# EAGLE design konektor_2 (EAGLE 6.3)
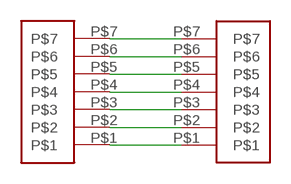
[diagram p0: schematic, sheet 1]

## Parts
U$1  7PIN  [7PIN]
U$2  7PIN  [7PIN]

## Nets
N$3: U$1.P$6 U$2.P$6
N$4: U$1.P$5 U$2.P$5
N$5: U$1.P$4 U$2.P$4
N$6: U$1.P$3 U$2.P$3
N$7: U$1.P$2 U$2.P$2
N$8: U$1.P$1 U$2.P$1
N$9: U$1.P$7 U$2.P$7

## Library data of the parts
U$1 U$2 = ref-packages:7PIN

## Board
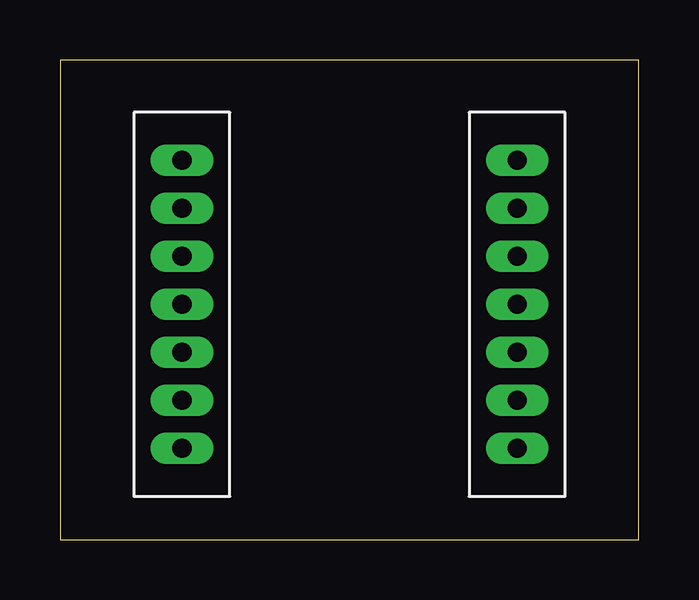
[diagram p1: board, top side]
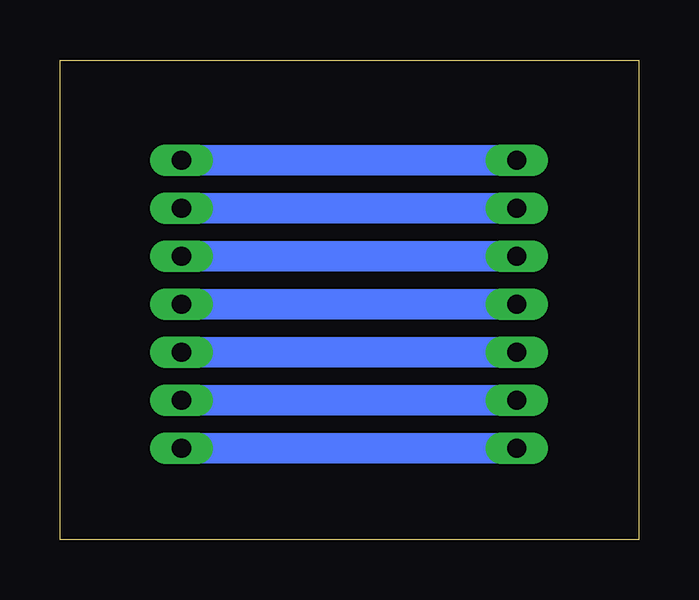
[diagram p2: board, bottom side, seen from below]

Size 24.11 x 19.99 mm. Coordinates in mm from the lower left corner, seen from the top.
Outline: 0,0 24.11,0 24.11,19.99 0,19.99 0,0
Copper layers (1*16): Top 0.035mm / dielectric 1.5mm / Bottom 0.035mm
Design rules "default": minimum track width 10mil, minimum drill 24mil, track to track 8mil, track to pad 8mil, pad to pad 8mil, via to via 8mil, smd to smd 8mil, copper to edge 40mil, drill to drill 8mil, minimum pad ring 10mil, minimum via ring 8mil, stop-mask expansion 4mil, vias tented up to drill 0mil, thermal gap 10mil

### Footprints (pad centres in the part's own frame; a part is rotated, then mirrored left to right if it is on the bottom)
7PIN = drill 0.8 long: P$1 0,0; P$2 2,0; P$3 4,0; P$4 6,0; P$5 8,0; P$6 10,0; P$7 12,0

### Placement (x,y rotation side)
U$1  19.05,3.81 90 top
U$2  5.08,3.81 90 top

### Tracks (layer width: path | path; a pad name or v marks a point on that pad's centre or on a via)
N$3
  Bottom 1.27: U$1.P$6 U$2.P$6
N$4
  Bottom 1.27: U$1.P$5 U$2.P$5
N$5
  Bottom 1.27: U$2.P$4 U$1.P$4
N$6
  Bottom 1.27: U$2.P$3 U$1.P$3
N$7
  Bottom 1.27: U$1.P$2 U$2.P$2
N$8
  Bottom 1.27: U$2.P$1 U$1.P$1
N$9
  Bottom 1.27: U$2.P$7 U$1.P$7